# Altium schematic sheet Sheet3.SchDoc
size OrCAD B
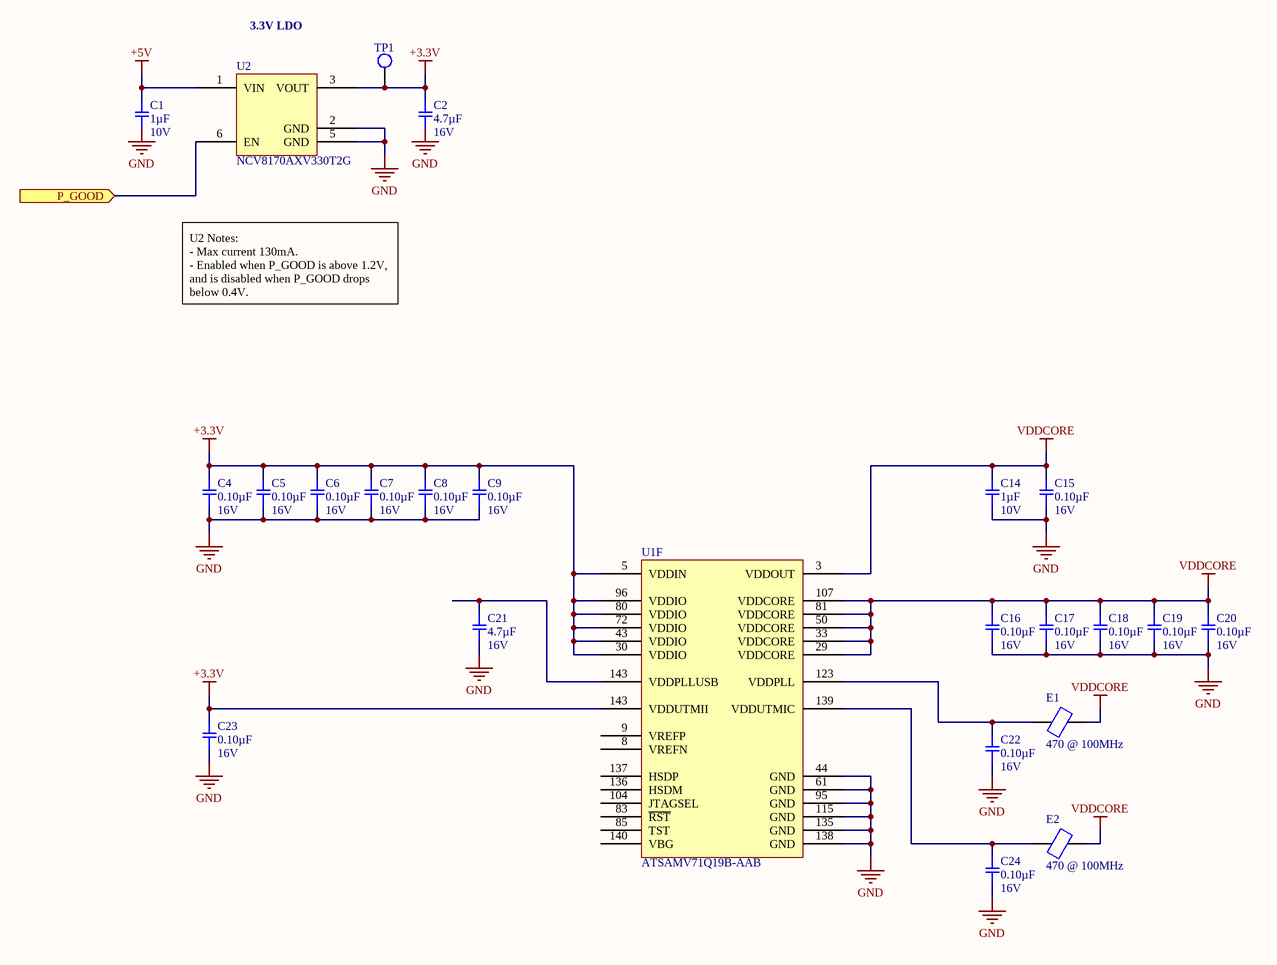
[diagram p0: Sheet3.SchDoc]

## Parts
C1  1µF  Voltage: 10V  [SMD-0402C]
C2  4.7µF  Voltage: 16V  [SMD-0805C]
C4  0.10µF  Voltage: 16V  [SMD-0402C]
C5  0.10µF  Voltage: 16V  [SMD-0402C]
C6  0.10µF  Voltage: 16V  [SMD-0402C]
C7  0.10µF  Voltage: 16V  [SMD-0402C]
C8  0.10µF  Voltage: 16V  [SMD-0402C]
C9  0.10µF  Voltage: 16V  [SMD-0402C]
C14  1µF  Voltage: 10V  [SMD-0402C]
C15  0.10µF  Voltage: 16V  [SMD-0402C]
C16  0.10µF  Voltage: 16V  [SMD-0402C]
C17  0.10µF  Voltage: 16V  [SMD-0402C]
C18  0.10µF  Voltage: 16V  [SMD-0402C]
C19  0.10µF  Voltage: 16V  [SMD-0402C]
C20  0.10µF  Voltage: 16V  [SMD-0402C]
C21  4.7µF  Voltage: 16V  [SMD-0805C]
C22  0.10µF  Voltage: 16V  [SMD-0402C]
C23  0.10µF  Voltage: 16V  [SMD-0402C]
C24  0.10µF  Voltage: 16V  [SMD-0402C]
E1  value 470 @ 100MHz  (hidden comment: MPZ1608S471ATD25)
E2  value 470 @ 100MHz  (hidden comment: MPZ1608S471ATD25)
TP1  TP  [TP_SMD_40]  (value not drawn)  (no BOM)
U1  ATSAMV71Q19B-AAB  [TSQFP50P2200X2200X160-144N]  (part F of 6)
U2  NCV8170AXV330T2G  [SOTFL50P160X60-6N]

## Ports
P_GOOD (in)

## Nets
+3.3V: C2.2 C4.2 C5.2 C6.2 C7.2 C8.2 C9.2 C23.2 TP1.1 U1.5(VDDIN) U1.30(VDDIO) U1.43(VDDIO) U1.72(VDDIO) U1.80(VDDIO) U1.96(VDDIO) U1.143(VDDUTMII) U2.3(VOUT)
+5V: C1.2 U2.1(VIN)
GND: C1.1 C2.1 C4.1 C5.1 C6.1 C7.1 C8.1 C9.1 C14.1 C15.1 C16.1 C17.1 C18.1 C19.1 C20.1 C21.1 C22.1 C23.1 C24.1 U1.44(GND) U1.61(GND) U1.95(GND) U1.115(GND) U1.135(GND) U1.138(GND) U2.2(GND) U2.5(GND)
VDDCORE: C14.2 C15.2 C16.2 C17.2 C18.2 C19.2 C20.2 E1.2 E2.2 U1.3(VDDOUT) U1.29(VDDCORE) U1.33(VDDCORE) U1.50(VDDCORE) U1.81(VDDCORE) U1.107(VDDCORE)
P_GOOD: U2.6(EN) ; port P_GOOD
NetC21_2: C21.2 U1.143(VDDPLLUSB)
NetC22_2: C22.2 E1.1 U1.123(VDDPLL)
NetC24_2: C24.2 E2.1 U1.139(VDDUTMIC)

Not connected (* = marked no-connect by the designer): U1 8(VREFN) 9(VREFP) 83(~{RST}) 85(TST) 104(JTAGSEL) 136(HSDM) 137(HSDP) 140(VBG)

## Notes on the sheet
- 3.3V LDO
- U2 Notes:
  - Max current 130mA.
  - Enabled when P_GOOD is above 1.2V, and is disabled when P_GOOD drops below 0.4V.
- Title
- Size:
- Date:
- Orcad B
- Number:
- Time:
- Revision:
- Sheet
- of
- File:

## Library data of the parts
C1 C14 = GCM155C71A105KE38D: CAP CER 1UF 10V X7S 0402; Manufacturer: Murata Electronics North America; Factory Stock: 0; Unit Price (USD): 0.12; Minimum Quantity: 1; Tolerance: ±10%; Datasheets: http://www.murata.com/~/media/webrenewal/support/library/catalog/products/capacitor/mlcc/c03e.ashx; Image: //media.digikey.com/Renders/Murata%20Renders/ZRB-SERIES-0402.jpg; Digi-Key Part Number: 490-13409-1-ND; Part Number: GCM155C71A105KE38D; Quantity Available: 7240; @ qty: 0; Packaging: Cut Tape (CT); Series: GCM; Part Status: Active; Value: 1µF; Temperature Coefficient: X7S; Operating Temperature: -55°C ~ 125°C; Features: -; Ratings: AEC-Q200; Applications: Automotive; Mounting Type: Surface Mount, MLCC; Package / Case: 0402 (1005 Metric); Size / Dimension: 0.039" L x 0.020" W (1.00mm x 0.50mm); Height - Seated (Max): -; Thickness (Max): 0.022" (0.55mm); Lead Spacing: -; Lead Style: -
C2 C21 = GCJ21BR71C475KA01L: CAP CER 4.7UF 16V X7R 0805; Manufacturer: Murata Electronics North America; Factory Stock: 0; Unit Price (USD): 0.44; Minimum Quantity: 1; Tolerance: ±10%; Datasheets: http://www.murata.com/~/media/webrenewal/support/library/catalog/products/capacitor/mlcc/c03e.ashx; Image: //media.digikey.com/Renders/Murata%20Renders/0805%20(2012%20Metric)%20.85mm.jpg; Digi-Key Part Number: 490-10557-1-ND; Part Number: GCJ21BR71C475KA01L; Quantity Available: 53217; @ qty: 0; Packaging: Cut Tape (CT); Series: GCJ; Part Status: Active; Value: 4.7µF; Temperature Coefficient: X7R; Operating Temperature: -55°C ~ 125°C; Features: Soft Termination; Ratings: AEC-Q200; Applications: Automotive, Boardflex Sensitive; Mounting Type: Surface Mount, MLCC; Package / Case: 0805 (2012 Metric); Size / Dimension: 0.079" L x 0.049" W (2.00mm x 1.25mm); Height - Seated (Max): -; Thickness (Max): 0.057" (1.45mm); Lead Spacing: -; Lead Style: -
C4-C9 C15-C20 C22-C24 = GCM155R71C104KA55D: CAP CER 0.1UF 16V X7R 0402; Manufacturer: Murata Electronics North America; Factory Stock: 0; Unit Price (USD): 0.1; Minimum Quantity: 1; Tolerance: ±10%; Datasheets: http://www.murata.com/~/media/webrenewal/support/library/catalog/products/capacitor/mlcc/c03e.ashx; Image: //media.digikey.com/Renders/Murata%20Renders/ZRB-SERIES-0402.jpg; Digi-Key Part Number: 490-4759-1-ND; Part Number: GCM155R71C104KA55D; Quantity Available: 734194; @ qty: 0; Packaging: Cut Tape (CT); Series: GCM; Part Status: Active; Value: 0.10µF; Temperature Coefficient: X7R; Operating Temperature: -55°C ~ 125°C; Features: -; Ratings: AEC-Q200; Applications: Automotive; Mounting Type: Surface Mount, MLCC; Package / Case: 0402 (1005 Metric); Size / Dimension: 0.039" L x 0.020" W (1.00mm x 0.50mm); Height - Seated (Max): -; Thickness (Max): 0.022" (0.55mm); Lead Spacing: -; Lead Style: -
E1 E2 = MPZ1608S471ATD25: DCR: 150mohm; Imax: 1A; Unit Price (USD): 0.10
U1 = ATSAMV71Q19B-AAB: Unit Price (USD): 10.74
U2 = NCV8170AXV330T2G: Unit Price (USD): 0.44